# EasyEDA schematic schematic-simple-power-native.json
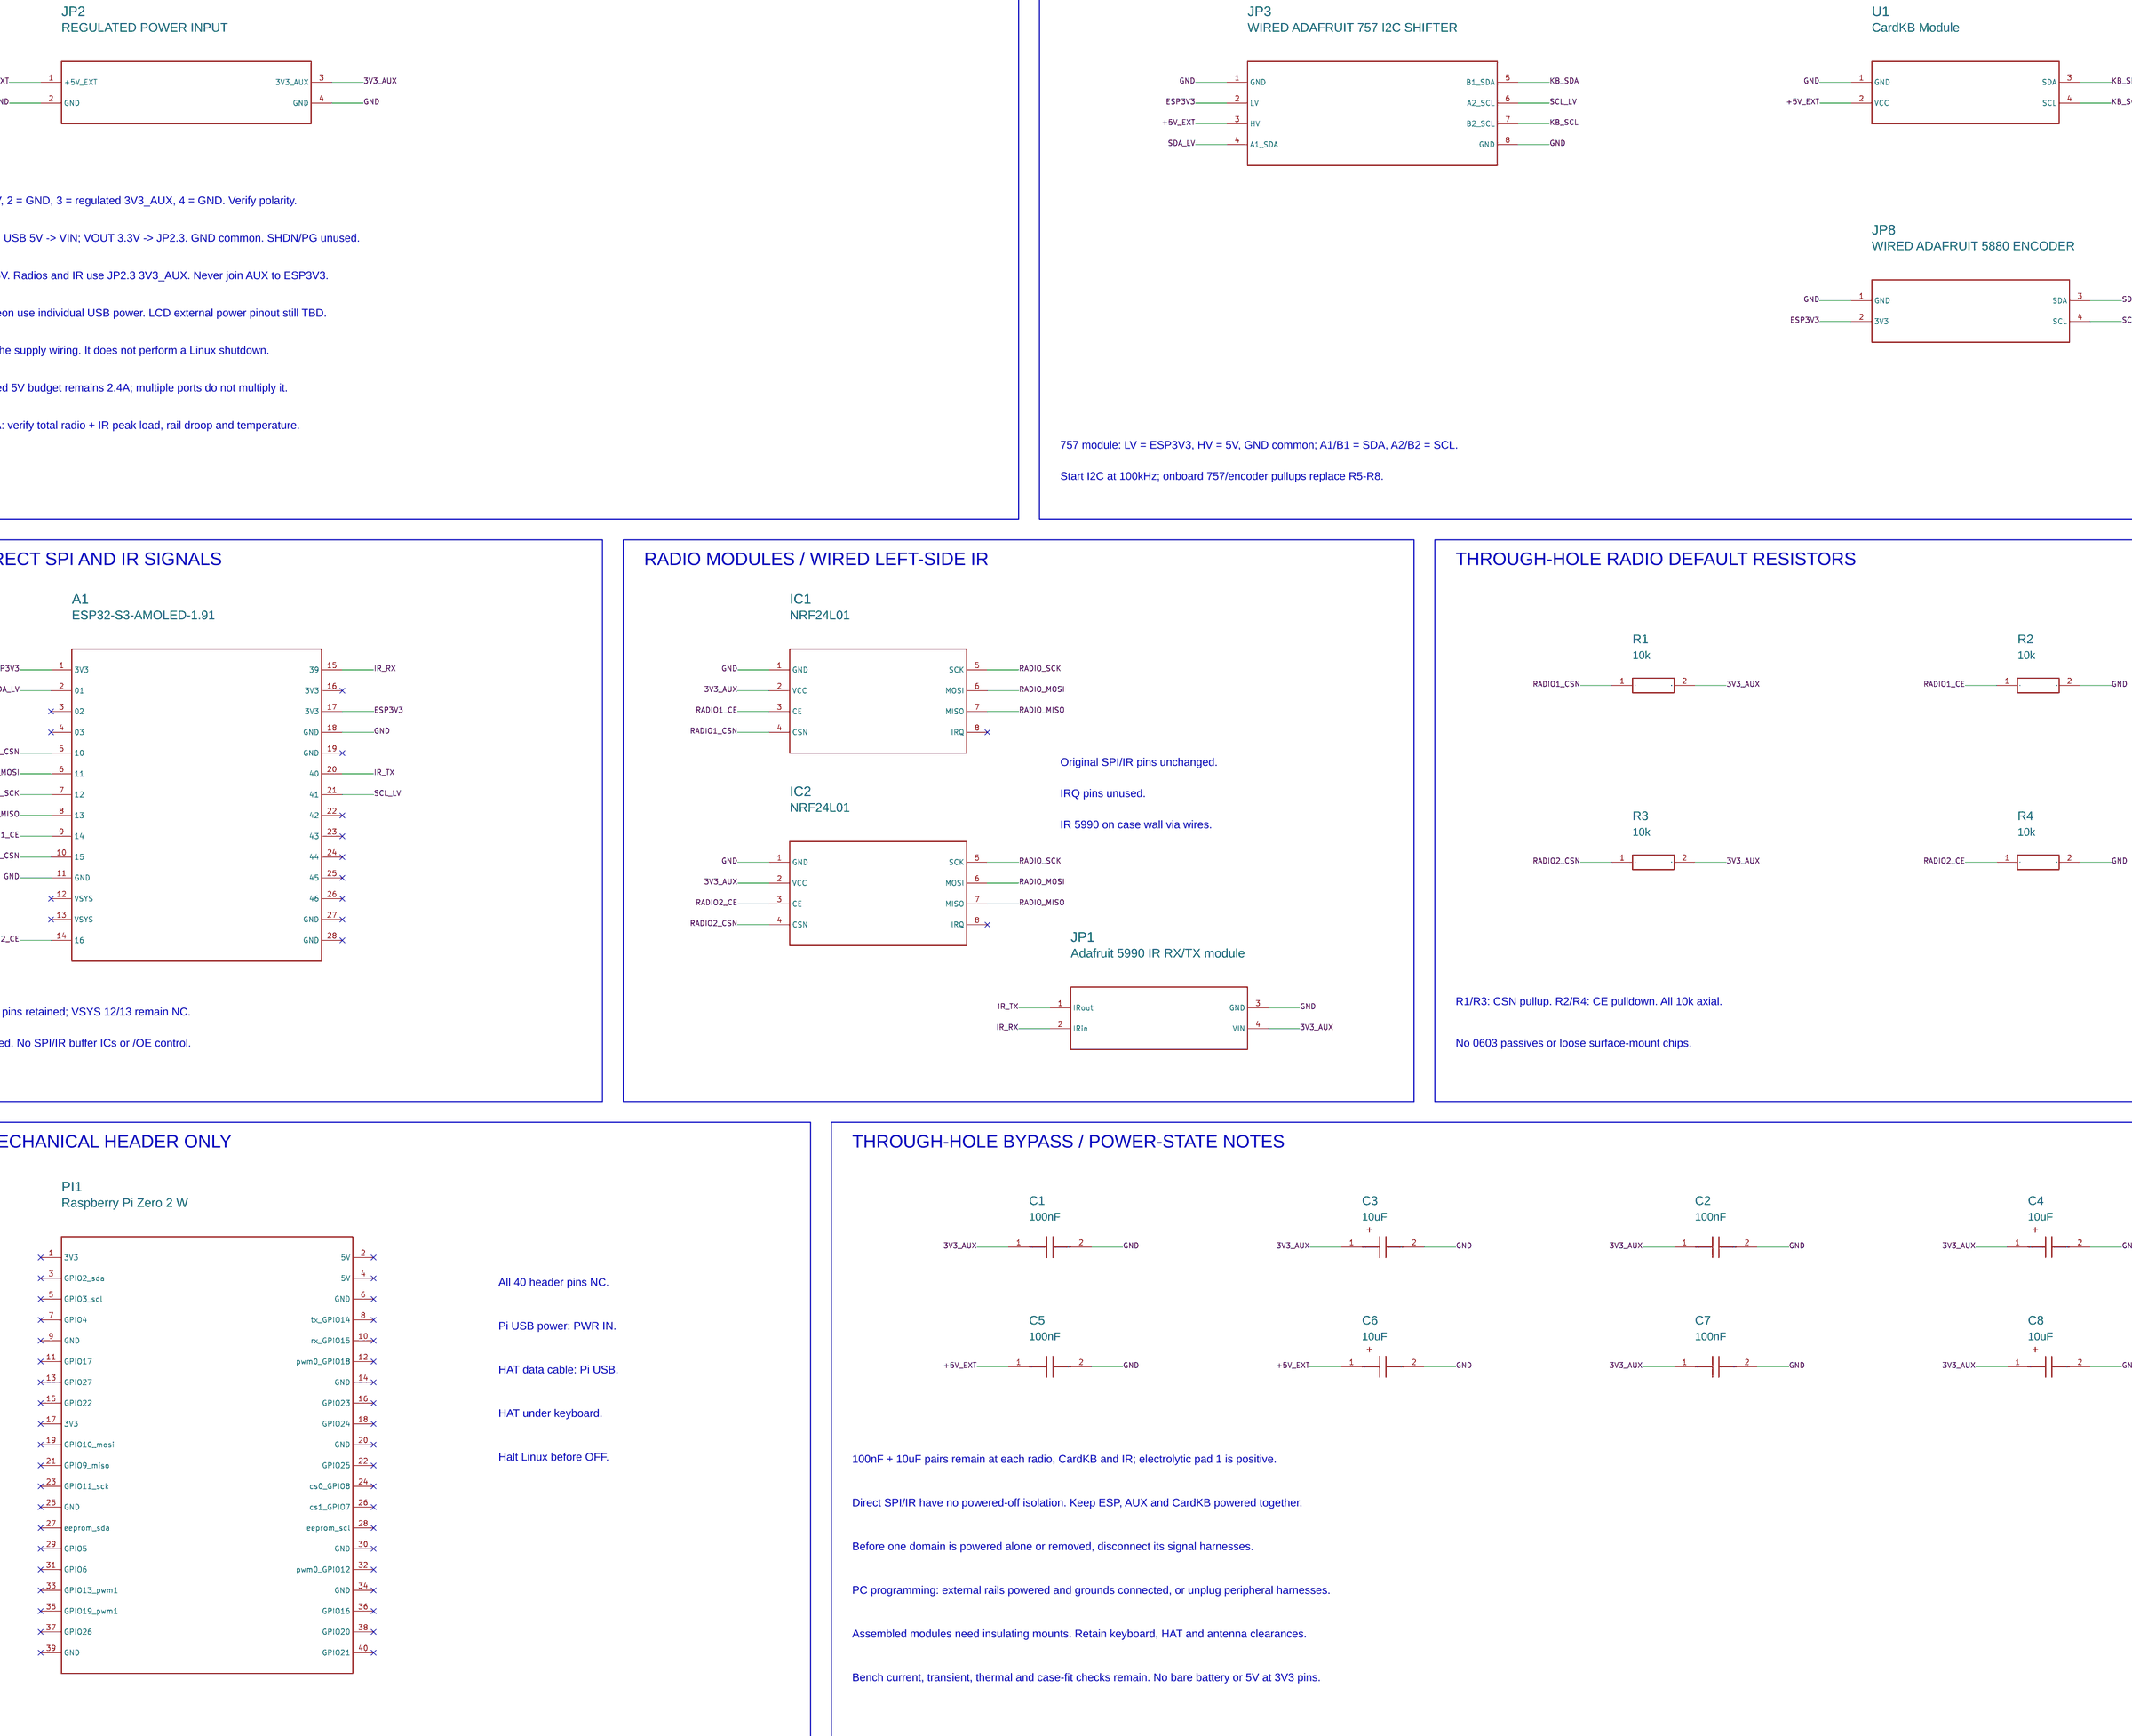
[diagram p0: schematic sheet]

## Parts
A1  ESP32-S3-AMOLED-1.91  [T-DISPLAY S3 AMOLED]
C1  100nF  [CERAMIC CAPACITOR 100NF 50V]
C2  100nF  [CERAMIC CAPACITOR 100NF 50V]
C3  10uF  [CAPACITOR 10UF TH FP]
C4  10uF  [CAPACITOR 10UF TH FP]
C5  100nF  [CERAMIC CAPACITOR 100NF 50V]
C6  10uF  [CAPACITOR 10UF TH FP]
C7  100nF  [CERAMIC CAPACITOR 100NF 50V]
C8  10uF  [CAPACITOR 10UF TH FP]
IC1  NRF24L01  [NRF24L01]
IC2  NRF24L01  [NRF24L01]
JP1  Adafruit 5990 IR RX/TX module  [HDR-1X4T/2.54/10X2_J9]
JP2  REGULATED POWER INPUT  [HDR-1X4T/2.54/10X2_J9]
JP3  WIRED ADAFRUIT 757 I2C SHIFTER  [HDR_1X8_THT_2P54]
JP8  WIRED ADAFRUIT 5880 ENCODER  [HDR_1X4_THT_2P54]
PI1  Raspberry Pi Zero 2 W  [RASPBERRY-PIZERO-W]
R1  10k  [R_AXIAL-0.3]
R2  10k  [R_AXIAL-0.3]
R3  10k  [R_AXIAL-0.3]
R4  10k  [R_AXIAL-0.3]
U1  CardKB Module  [NXW-04K]

## Library data of the parts
A1 = ESP32-S3-AMOLED-1.91: Manufacturer: Lilygo; Manufacturer Part: T-Display S3 AMOLED; Supplier: Lilygo; link: https://www.lilygo.cc/products/t-display-s3-amoled; Contributor: adamzh
C1 C2 C5 C7 = Ceramic capacitor 100nf 50V: Contributor: pampamapam
C3 C4 C6 C8 = Capacitor 10uF TH: Contributor: airyrahman
IC1 IC2 = NRF24L01: Contributor: JoachimHugo1
JP1 JP2 = M04: Contributor: SparkFun
JP3 = WIRED ADAFRUIT 757 I2C SHIFTER: Manufacturer Part: THROUGH-HOLE WIRE HARNESS; Footprint Status: VERIFIED DEFINITION IN COMPONENT MAP
JP8 = WIRED ADAFRUIT 5880 ENCODER: Manufacturer Part: THROUGH-HOLE WIRE HARNESS; Footprint Status: VERIFIED DEFINITION IN COMPONENT MAP
PI1 = PI ZERO2 WDADAD: Contributor: greg_dickson
R1-R4 = Resistor
U1 = CardKB Module: Manufacturer: M5Stack; Manufacturer Part: CardKB; Supplier Part: NXW-03K; Contributor: cane.cave

## Nets
3V3_AUX: C1.1 C2.1 C3.1 C4.1 C7.1 C8.1 IC1.2(VCC) IC2.2(VCC) JP1.4(VIN) JP2.3(3V3_AUX) R1.2 R3.2
+5V_EXT: C5.1 C6.1 JP2.1(+5V_EXT) JP3.3(HV) U1.2(VCC)
GND: A1.11(GND) A1.18(GND) C1.2 C2.2 C3.2 C4.2 C5.2 C6.2 C7.2 C8.2 IC1.1(GND) IC2.1(GND) JP1.3(GND) JP2.2(GND) JP2.4(GND) JP3.1(GND) JP3.8(GND) JP8.1(GND) R2.2 R4.2 U1.1(GND)
ESP3V3: A1.1(3V3) A1.17(3V3) JP3.2(LV) JP8.2(3V3)
IR_RX: A1.15(39) JP1.2(IRin)
IR_TX: A1.20(40) JP1.1(IRout)
KB_SCL: JP3.7(B2 SCL) U1.4(SCL)
KB_SDA: JP3.5(B1 SDA) U1.3(SDA)
RADIO1_CE: A1.9(14) IC1.3(CE) R2.1
RADIO1_CSN: A1.5(10) IC1.4(CSN) R1.1
RADIO2_CE: A1.14(16) IC2.3(CE) R4.1
RADIO2_CSN: A1.10(15) IC2.4(CSN) R3.1
RADIO_MISO: A1.8(13) IC1.7(MISO) IC2.7(MISO)
RADIO_MOSI: A1.6(11) IC1.6(MOSI) IC2.6(MOSI)
RADIO_SCK: A1.7(12) IC1.5(SCK) IC2.5(SCK)
SCL_LV: A1.21(41) JP3.6(A2 SCL) JP8.4(SCL)
SDA_LV: A1.2(01) JP3.4(A1 SDA) JP8.3(SDA)

Not connected (* = marked no-connect by the designer): A1 3(02)* 4(03)* 12(VSYS)* 13(VSYS)* 16(3V3)* 19(GND)* 22(42)* 23(43)* 24(44)* 25(45)* 26(46)* 27(GND)* 28(GND)*; IC1 8(IRQ)*; IC2 8(IRQ)*; PI1 1(3V3)* 2(5V)* 3(GPIO2 sda)* 4(5V)* 5(GPIO3 scl)* 6(GND)* 7(GPIO4)* 8(tx GPIO14)* 9(GND)* 10(rx GPIO15)* 11(GPIO17)* 12(pwm0 GPIO18)* 13(GPIO27)* 14(GND)* 15(GPIO22)* 16(GPIO23)* 17(3V3)* 18(GPIO24)* 19(GPIO10 mosi)* 20(GND)* 21(GPIO9 miso)* 22(GPIO25)* 23(GPIO11 sck)* 24(cs0 GPIO8)* 25(GND)* 26(cs1 GPIO7)* 27(eeprom sda)* 28(eeprom scl)* 29(GPIO5)* 30(GND)* 31(GPIO6)* 32(pwm0 GPIO12)* 33(GPIO13 pwm1)* 34(GND)* 35(GPIO19 pwm1)* 36(GPIO16)* 37(GPIO26)* 38(GPIO20)* 39(GND)* 40(GPIO21)*

## Notes on the sheet
- CYBERDECK / SIMPLE PERIPHERAL CARRIER
- Single sheet | 2026-10-02 | External assembled supplies and level shifter | Named nets join on this sheet
- EXTERNAL REGULATED POWER / SIMPLE CARRIER
- PREASSEMBLED I2C SHIFTER / KEYBOARD / ENCODER
- JP2: 1 = regulated 5V, 2 = GND, 3 = regulated 3V3_AUX, 4 = GND. Verify polarity.
- Off-PCB Pololu 2830: USB 5V -> VIN; VOUT 3.3V -> JP2.3. GND common. SHDN/PG unused.
- CardKB uses JP2.1 5V. Radios and IR use JP2.3 3V3_AUX. Never join AUX to ESP3V3.
- Pi, ESP and Chameleon use individual USB power. LCD external power pinout still TBD.
- Switch is external in the supply wiring. It does not perform a Linux shutdown.
- Miady per-bank shared 5V budget remains 2.4A; multiple ports do not multiply it.
- Regulator nominal 1A: verify total radio + IR peak load, rail droop and temperature.
- 757 module: LV = ESP3V3, HV = 5V, GND common; A1/B1 = SDA, A2/B2 = SCL.
- Start I2C at 100kHz; onboard 757/encoder pullups replace R5-R8.
- LILYGO / DIRECT SPI AND IR SIGNALS
- RADIO MODULES / WIRED LEFT-SIDE IR
- THROUGH-HOLE RADIO DEFAULT RESISTORS
- Original SPI/IR pins unchanged.
- IRQ pins unused.
- IR 5990 on case wall via wires.
- R1/R3: CSN pullup. R2/R4: CE pulldown. All 10k axial.
- All 28 original header pins retained; VSYS 12/13 remain NC.
- GPIO2 remains unused. No SPI/IR buffer ICs or /OE control.
- No 0603 passives or loose surface-mount chips.
- PI ZERO / MECHANICAL HEADER ONLY
- THROUGH-HOLE BYPASS / POWER-STATE NOTES
- All 40 header pins NC.
- Pi USB power: PWR IN.
- HAT data cable: Pi USB.
- HAT under keyboard.
- Halt Linux before OFF.
- 100nF + 10uF pairs remain at each radio, CardKB and IR; electrolytic pad 1 is positive.
- Direct SPI/IR have no powered-off isolation. Keep ESP, AUX and CardKB powered together.
- Before one domain is powered alone or removed, disconnect its signal harnesses.
- PC programming: external rails powered and grounds connected, or unplug peripheral harnesses.
- Assembled modules need insulating mounts. Retain keyboard, HAT and antenna clearances.
- Bench current, transient, thermal and case-fit checks remain. No bare battery or 5V at 3V3 pins.
